# EAGLE design MIKE - Arduino-Pro-Mini-v10 KeyPad interface V2 (EAGLE 5.10)
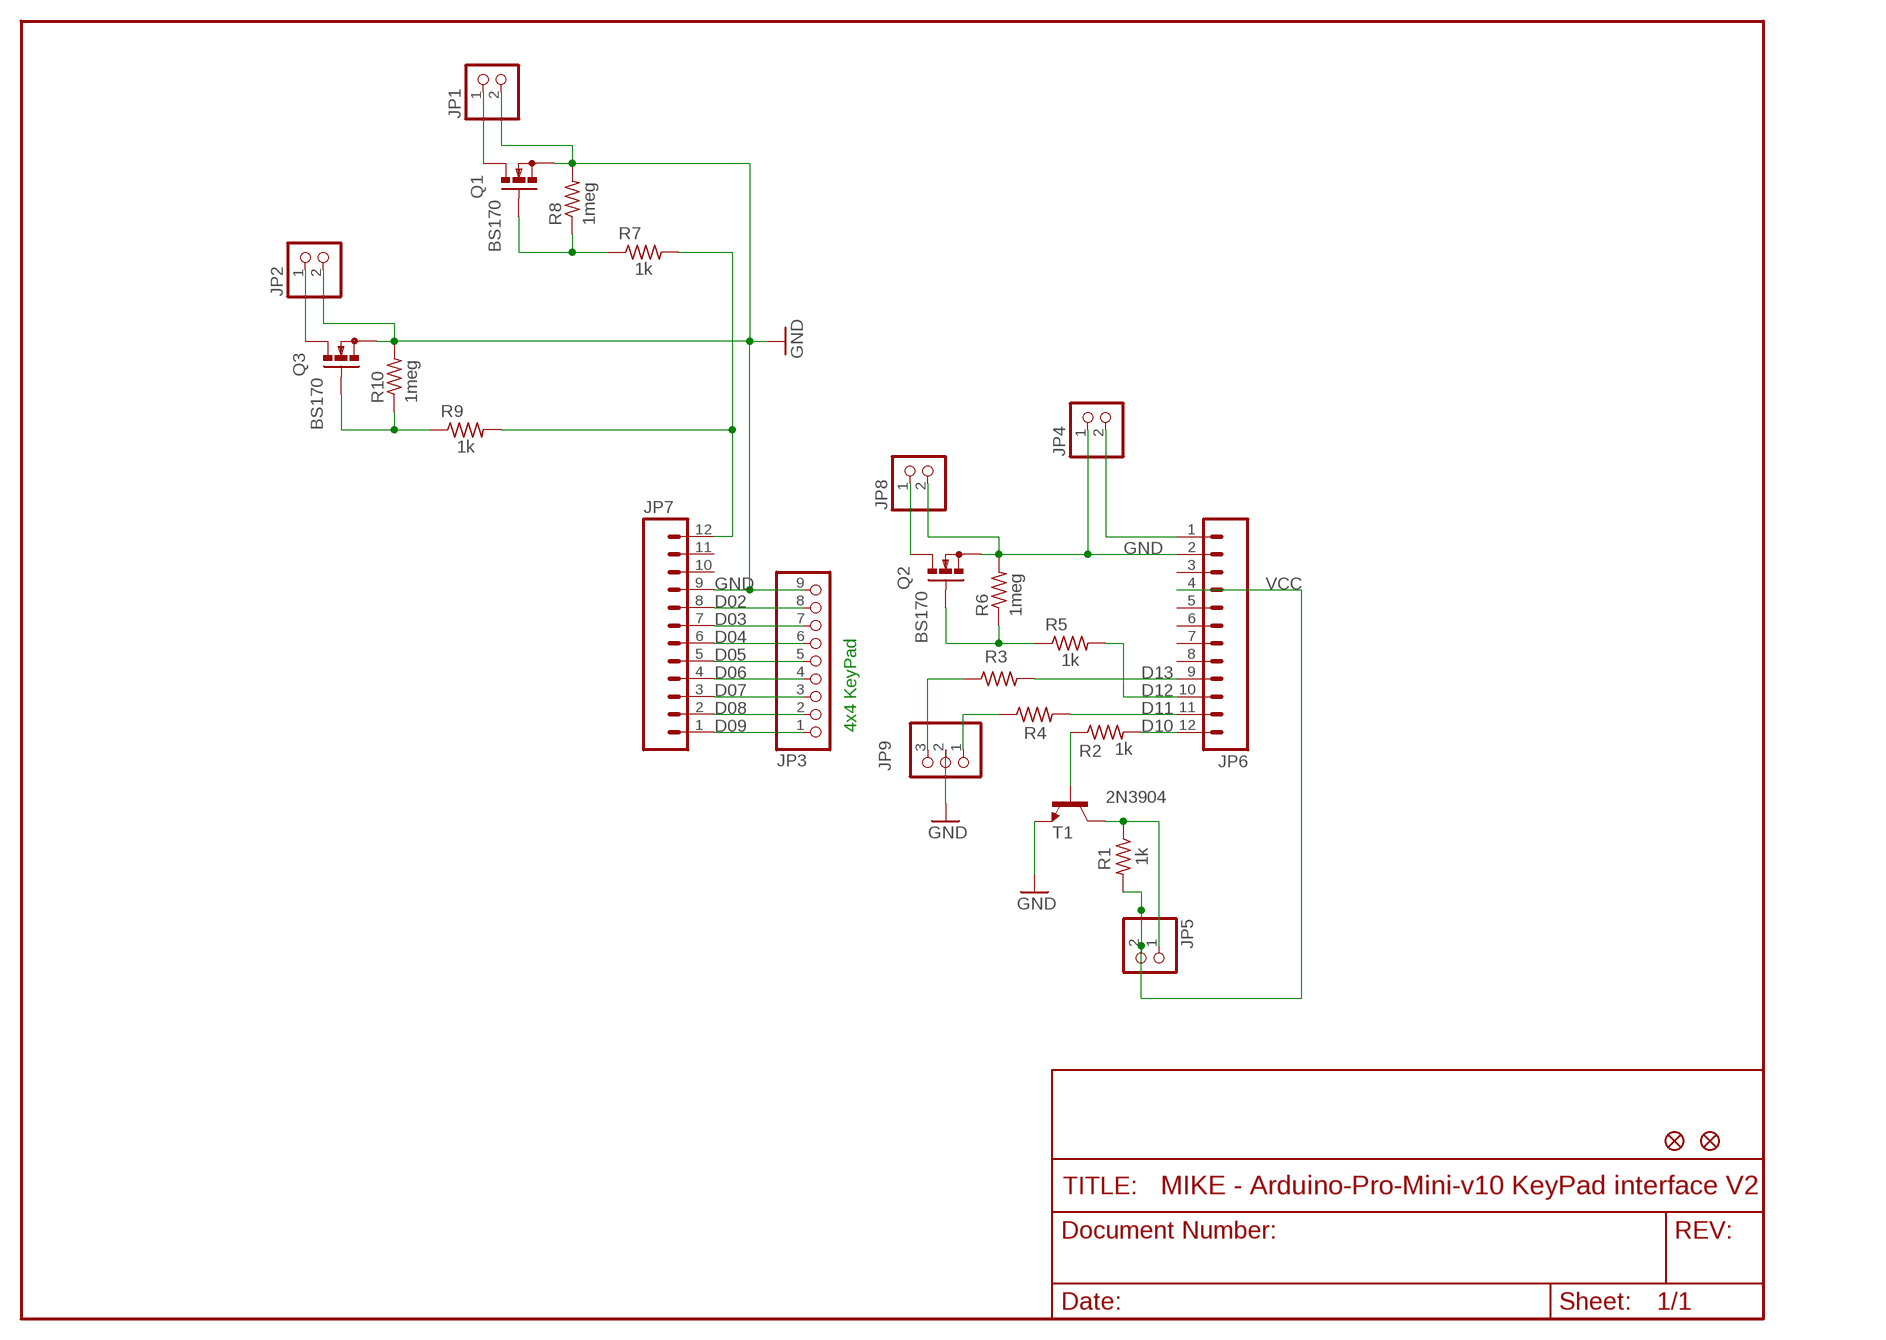
[diagram p0: schematic, sheet 1]

## Parts
JP1  PINHD-1X2  [1X02]
JP2  PINHD-1X2  [1X02]
JP3  PINHD-1X9  [1X09]
JP4  PINHD-1X2  [1X02]
JP5  PINHD-1X2  [1X02]
JP6  M12PTH  [1X12]
JP7  M12PTH  [1X12]
JP8  PINHD-1X2  [1X02]
JP9  PINHD-1X3  [1X03]
Q1  BS170  [SOT54E]
Q2  BS170  [SOT54E]
Q3  BS170  [SOT54E]
R1  1k  R-US_0207/7  [0207/7]
R2  1k  R-US_0207/7  [0207/7]
R3  R-US_0207/7  [0207/7]
R4  R-US_0207/7  [0207/7]
R5  1k  R-US_0207/7  [0207/7]
R6  1meg  R-US_0207/7  [0207/7]
R7  1k  R-US_0207/7  [0207/7]
R8  1meg  R-US_0207/7  [0207/7]
R9  1k  R-US_0207/7  [0207/7]
R10  1meg  R-US_0207/7  [0207/7]
T1  2N3904  [TO92]
U$2  FIDUCIAL1X2  [FIDUCIAL-1X2]
U$4  FIDUCIAL1X2  [FIDUCIAL-1X2]

## Nets
D02: JP3.8 JP7.8
D03: JP3.7 JP7.7
D04: JP3.6 JP7.6
D05: JP3.5 JP7.5
D06: JP3.4 JP7.4
D07: JP3.3 JP7.3
D08: JP3.2 JP7.2
D09: JP3.1 JP7.1
D10: JP6.12 R2.2
D11: JP6.11 R4.2
D12: JP6.10 R5.2
D13: JP6.9 R3.2
GND [vcc]: JP1.2 JP2.2 JP3.9 JP4.1 JP6.2 JP7.9 JP8.2 JP9.2 Q1.S Q2.S Q3.S R6.2 R8.2 R10.2 T1.3(E)
N$1: Q1.G R7.1 R8.1
N$2: JP8.1 Q2.D
N$3: JP1.1 Q1.D
N$4: Q3.G R9.1 R10.1
N$5: JP2.1 Q3.D
N$6: JP4.2 JP6.1
N$7: JP7.12 R7.2 R9.2
N$10: R2.1 T1.2(B)
N$11: JP5.1 R1.1 T1.1(C)
N$13: JP9.3 R3.1
N$15: JP9.1 R4.1
N$19: Q2.G R5.1 R6.1
VCC: JP5.2 JP6.4 R1.2
Unconnected: JP6.3 JP6.5 JP6.6 JP6.7 JP6.8 JP7.10 JP7.11

## Notes on the sheet
- 4x4 KeyPad

## Library data of the parts
JP1 JP2 JP4 JP5 JP8 = pinhead:PINHD-1X2: PIN HEADER
JP3 = pinhead:PINHD-1X9: PIN HEADER
JP6 JP7 = SparkFun:M12: Header 12 Standard 12-pin 0.1" header. Use with straight break away headers (SKU : PRT-00116), right angle break away headers (PRT-00553), swiss pins (PRT-00743), machine pins (PRT-00117), and female headers (PRT-00115).
JP9 = pinhead:PINHD-1X3: PIN HEADER
Q1-Q3 = transistor-small-signal:BS170: N-CHANNEL MOS FET
R1-R10 = rcl:R-US_: RESISTOR, American symbol
T1 = transistor-neu-to92:2N3904: NPN TRANSISTOR
U$2 U$4 = SparkFun:FIDUCIAL: Fiducial Alignment Points Various fiducial points for machine vision alignment.

## Net classes
0 default: width 0.203 mm
1 vcc: width 0.254 mm

## Board
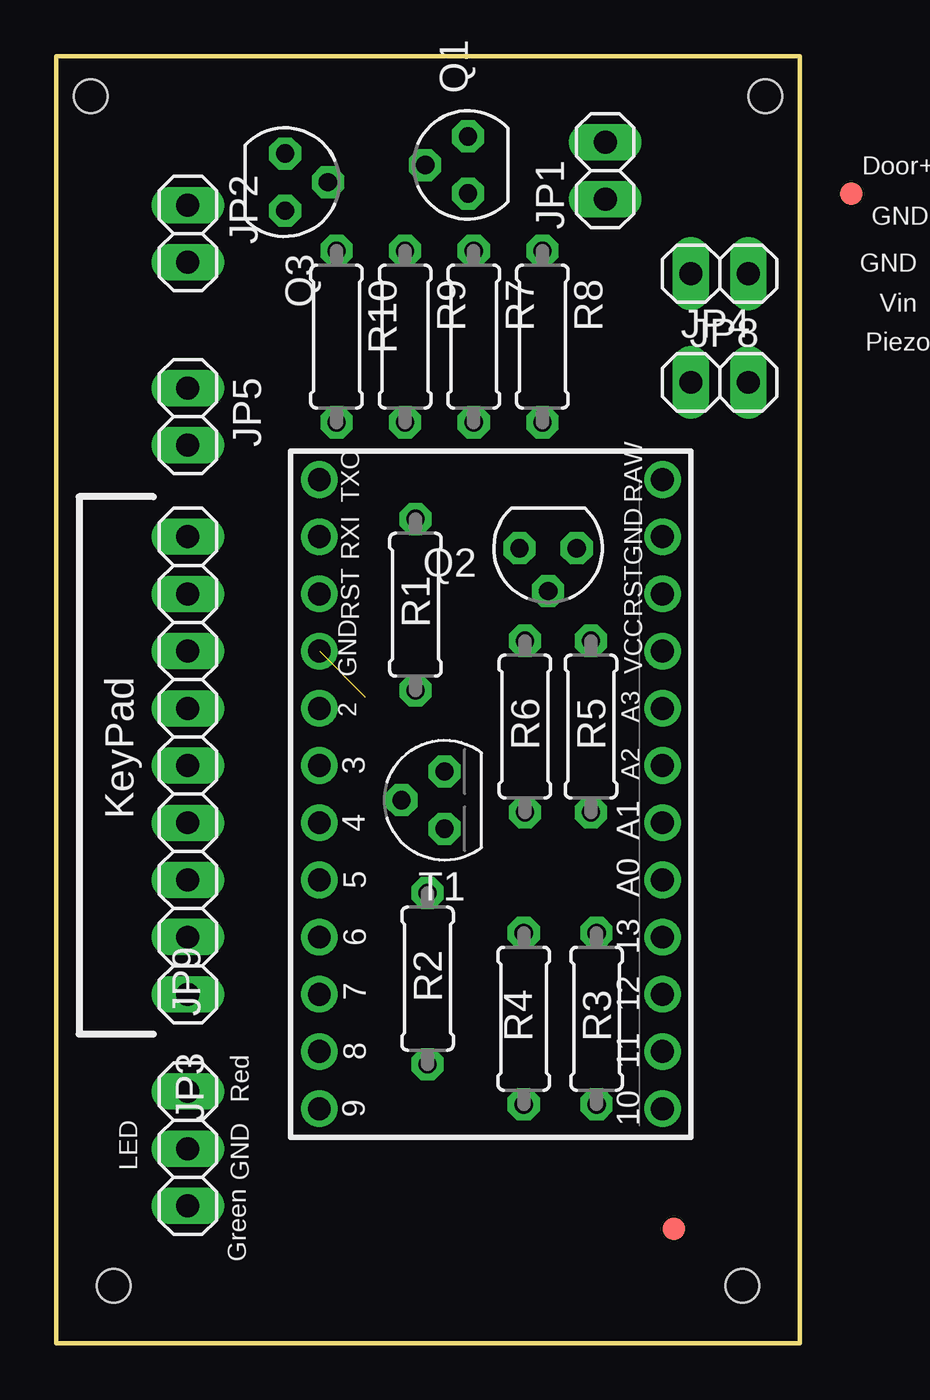
[diagram p1: board, top side]
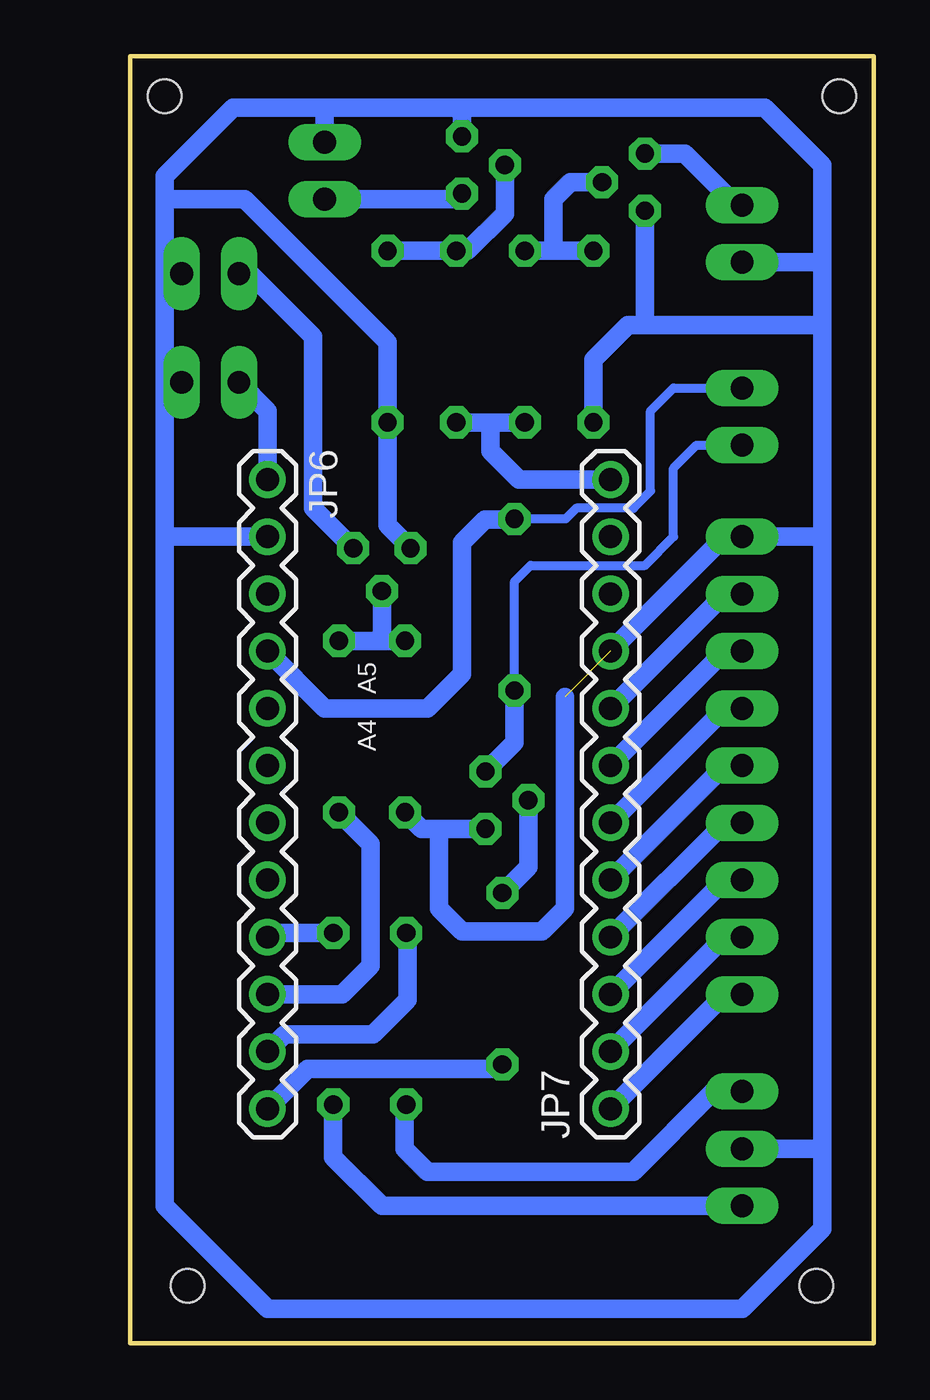
[diagram p2: board, bottom side, seen from below]

Size 33.02 x 57.15 mm. Coordinates in mm from the lower left corner, seen from the top.
Outline: 0,57.15 0,0 33.02,0 33.02,57.15 0,57.15
Copper layers (1*16): Top 0.035mm / dielectric 1.5mm / Bottom 0.035mm
Design rules "SparkFun *": minimum track width 8mil, minimum drill 20mil, track to track 8mil, track to pad 8mil, pad to pad 8mil, via to via 8mil, smd to smd 8mil, copper to edge 10mil, drill to drill 8mil, minimum pad ring 12mil, minimum via ring 10mil, stop-mask expansion 4mil, vias tented up to drill 20mil, thermal gap 10mil
Holes 1.5 mm at 2.54,2.54 30.48,2.54 31.5,55.37 1.52,55.37

### Footprints (pad centres in the part's own frame; a part is rotated, then mirrored left to right if it is on the bottom)
1X02 = drill 1.016 long: 1 -1.27,0; 2 1.27,0
1X09 = drill 1.016 long: 1 -10.16,0; 2 -7.62,0; 3 -5.08,0; 4 -2.54,0; 5 0,0; 6 2.54,0; 7 5.08,0; 8 7.62,0; 9 10.16,0
1X12 = drill 1.016 round: 1 0,0; 2 2.54,0; 3 5.08,0; 4 7.62,0; 5 10.16,0; 6 12.7,0; 7 15.24,0; 8 17.78,0; 9 20.32,0; 10 22.86,0; 11 25.4,0; 12 27.94,0
1X03 = drill 1.016 long: 1 -2.54,0; 2 0,0; 3 2.54,0
SOT54E = drill 0.813 octagon: D -1.27,0; G 0,1.905; S 1.27,0
0207/7 = drill 0.813 octagon: 1 -3.81,0; 2 3.81,0
TO92 = drill 0.813 octagon: 1 1.27,0; 2 0,1.905; 3 -1.27,0
FIDUCIAL-1X2 = smd 1 x 1: 1 0,0

### Placement (x,y rotation side)
JP1  24.38,52.07 90 top
JP2  5.84,49.28 270 top
JP3  5.84,25.65 90 top
JP4  29.46,42.67 180 top
JP5  5.84,41.15 90 top
JP6  26.92,38.35 270 bottom
JP7  11.68,10.41 90 bottom
JP8  29.46,47.5 0 top
JP9  5.84,8.64 270 top
Q1  18.29,52.32 90 top
Q2  21.84,35.31 180 top
Q3  10.16,51.56 270 top
R1  15.95,32.79 90 top
R2  16.49,16.19 270 top
R3  24,14.41 90 top
R4  20.76,14.41 90 top
R5  23.75,27.38 270 top
R6  20.81,27.38 270 top
R7  18.54,44.7 270 top
R8  21.59,44.7 270 top
R9  15.49,44.7 270 top
R10  12.45,44.7 270 top
T1  17.24,24.12 90 top
U$2  27.43,5.08 0 top
U$4  35.31,51.05 0 top

### Tracks (layer width: path | path; a pad name or v marks a point on that pad's centre or on a via)
D02
  Bottom 0.813: JP3.8 6.6,33.27 JP7.8
D03
  Bottom 0.813: JP3.7 6.6,30.73 JP7.7
D04
  Bottom 0.813: JP3.6 6.6,28.19 JP7.6
D05
  Bottom 0.813: JP3.5 6.6,25.65 JP7.5
D06
  Bottom 0.813: JP3.4 6.6,23.11 JP7.4
D07
  Bottom 0.813: JP3.3 6.6,20.57 JP7.3
D08
  Bottom 0.813: JP3.2 6.6,18.03 JP7.2
D09
  Bottom 0.813: JP3.1 6.6,15.49 JP7.1
D10
  Bottom 0.813: JP6.12 25.15,12.19 16.68,12.19 R2.2
D11
  Bottom 0.813: R4.2 20.7,18.16 20.7,15.24 22.23,13.72 26.16,13.72 JP6.11
D12
  Bottom 0.813: JP6.10 23.62,15.49 22.35,16.76 22.35,22.18 R5.2
D13
  Bottom 0.813: R3.2 26.74,18.22 JP6.9
GND  (1 unrouted)
  Bottom 0.813: 26.76,35.65 JP6.2 31.24,35.81 31.5,36.07 | 2.29,8.64 2.29,5.08 5.84,1.52 26.92,1.52 31.5,6.1 31.5,36.07 | 2.29,8.64 JP9.2 | 19.3,22.85 T1.3 | 19.3,22.85 20.09,22.85 R6.2 | 13.72,28.7 13.72,19.3 14.73,18.29 18.29,18.29 19.3,19.3 19.3,22.85 | JP7.9 6.6,35.81 JP3.9 2.54,35.81 2.29,35.56 | 31.5,36.07 31.5,42.67 | 31.5,42.67 31.5,47.5 | 31.5,47.5 31.5,50.8 | 31.5,50.8 31.5,51.82 28.45,54.86 24.38,54.86 | 2.29,8.64 2.29,35.56 | 2.29,35.56 2.29,45.21 | 2.29,45.21 2.29,48.01 | 31.5,47.5 JP8.2 | 31.5,42.67 JP4.1 | 2.29,48.01 JP2.2 | R10.2 12.45,43.69 10.92,45.21 9.91,45.21 | 2.29,45.21 9.91,45.21 | 31.5,50.8 27.94,50.8 21.59,44.45 R8.2 21.59,36.32 Q2.S | 18.54,54.86 4.83,54.86 2.29,52.32 2.29,48.01 | 18.54,54.86 24.38,54.86 | 24.38,54.86 JP1.2 | Q1.S 18.29,54.61 18.54,54.86 | Q3.S 10.16,45.47 9.91,45.21
N$1
  Bottom 0.813: R8.1 R7.1 18.03,48.51 16.38,50.16 Q1.G
N$2
  Bottom 0.813: JP8.1 27.69,47.5 24.89,44.7 24.89,37.08 Q2.D
N$3
  Bottom 0.813: JP1.1 18.54,50.8 Q1.D
N$4
  Bottom 0.813: R10.1 13.97,48.51 | 13.97,48.51 R9.1 | Q3.G 13.46,51.56 14.22,50.8 14.22,48.77 13.97,48.51
N$5
  Bottom 0.813: JP2.1 6.1,50.55 8.38,52.83 Q3.D
N$6
  Bottom 0.813: JP6.1 26.92,41.4 JP4.2
N$7
  Bottom 0.813: 17.27,40.89 R9.2 | 17.27,40.89 R7.2 | JP7.12 15.75,38.35 17.02,39.62 17.02,40.64 17.27,40.89
N$10
  Bottom 0.813: T1.2 15.34,21.15 R2.1
N$11
  Bottom 0.406: R1.1 15.95,33.83 15.24,34.54 10.16,34.54 8.89,35.81 8.89,38.86 7.87,39.88 JP5.1
  Bottom 0.813: R1.1 15.95,26.68 T1.1
N$13
  Bottom 0.813: JP9.3 21.84,6.1 24,8.26 R3.1
N$15
  Bottom 0.813: JP9.1 7.11,11.18 10.67,7.62 19.81,7.62 20.83,8.64 20.83,10.54 R4.1
N$19
  Bottom 0.813: R6.1 22.1,31.19 | 22.1,31.19 R5.1 | Q2.G 21.84,31.45 22.1,31.19
VCC
  Bottom 0.406: R1.2 13.69,36.6 13.21,37.08 10.67,37.08 9.91,37.85 9.91,41.4 8.89,42.42 JP5.2
  Bottom 0.813: JP6.4 24.38,28.19 19.81,28.19 18.29,29.72 18.29,35.56 17.27,36.58 15.98,36.58 R1.2

### Text on the board
tPlace: Door+ | GND | GND | Vin | Piezo | TXO | RAW | RXI | GND | RST | RST | KeyPad | GND | VCC | 2 | A3 | 3 | A2 | 4 | A1 | 5 | A0 | 6 | 13 | 7 | 12 | Red | 8 | 11 | LED | GND | 9 | 10 | Green
bPlace: A5 | A4